# EAGLE design Wallboxsteuerung22042021 (EAGLE 7.5.0)
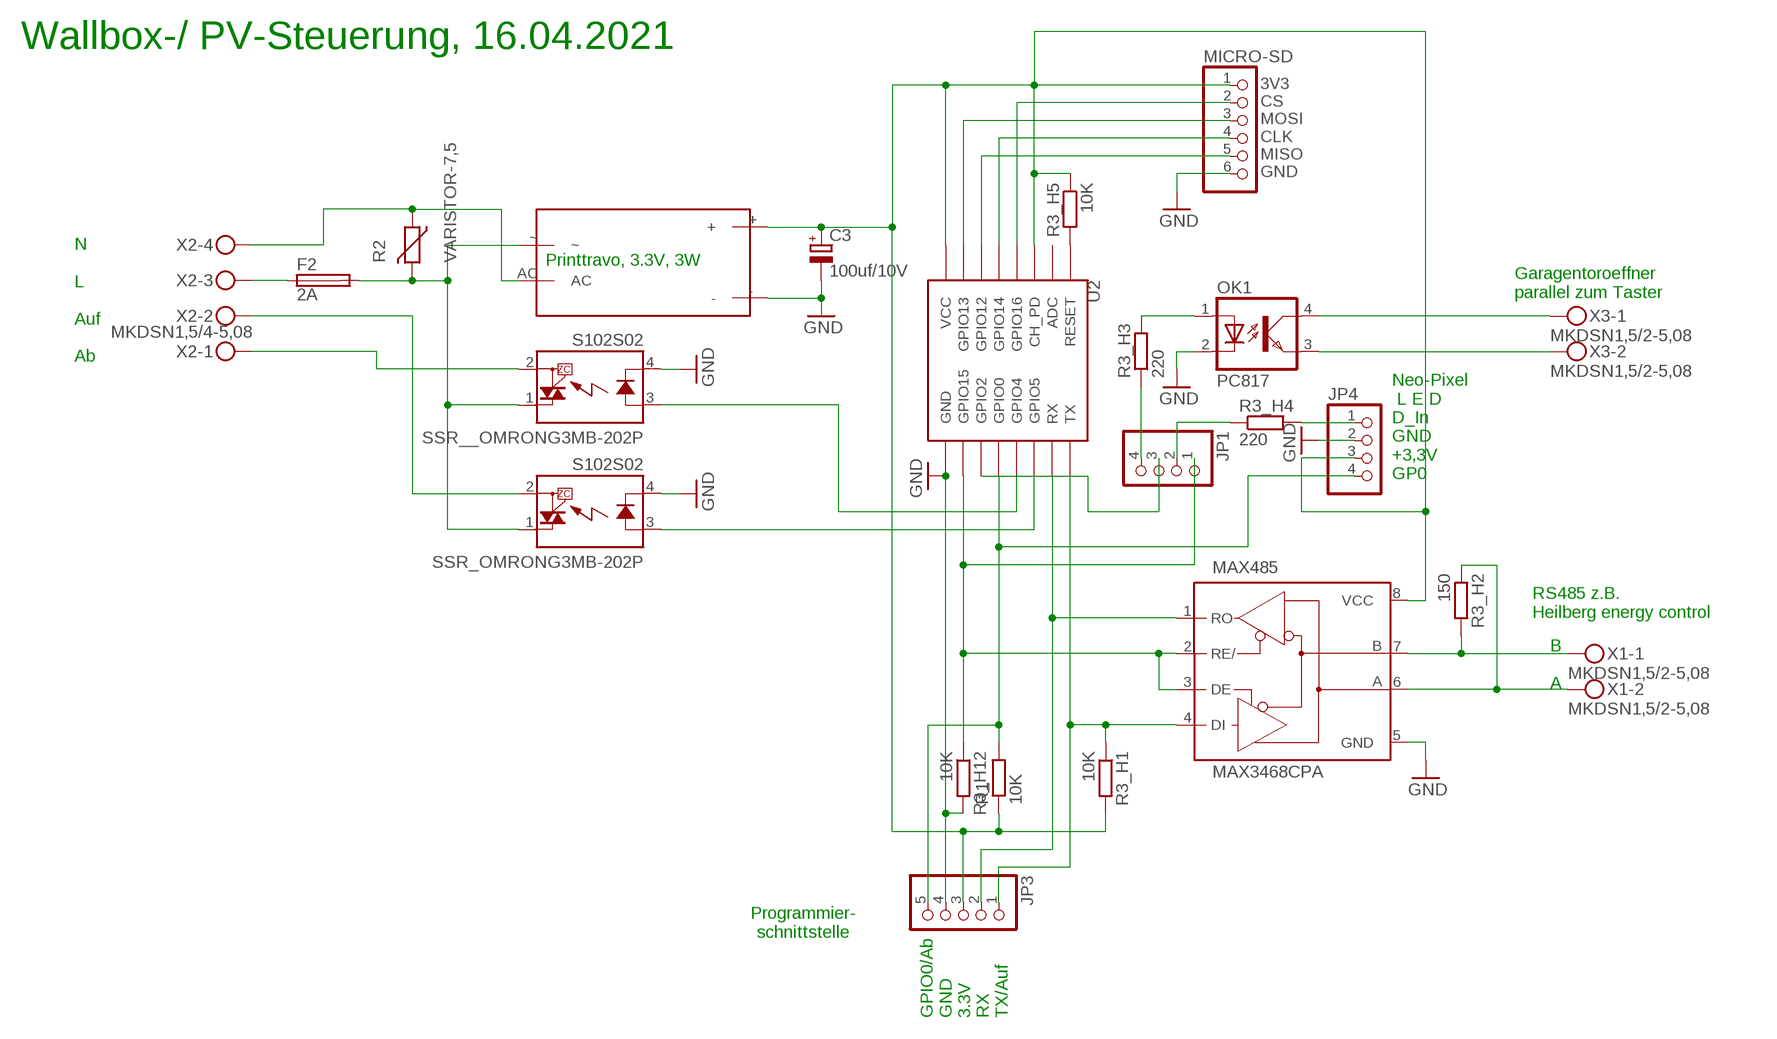
[diagram p0: schematic, sheet 1]

## Parts
C3  100uf/10V  CPOL-EUE2.5-7  [E2,5-7]
F2  2A  LITTLEFUSE  [LITTLEFUSE]
JP1  PINHD-1X4  [1X04]
JP3  PINHD-1X5  [1X05]
JP4  PINHD-1X4  [1X04]
MAX485  MAX3468CPA  [DIL08]
MICRO-SD  PINHD-1X6  [1X06]
OK1  PC817  [DIL04]
PRINTTRAFO3.3V,_3W  PRINTTRAFO  [PRINTTRAFO]
R1  10K  R-EU_0207/7  [0207/7]
R2  VARISTOR-7,5  [R-7,5]
R3_H1  10K  R-EU_0309/V  [0309V]
R3_H2  150  R-EU_0309/V  [0309V]
R3_H3  220  R-EU_0309/V  [0309V]
R3_H4  220  R-EU_0309/V  [0309V]
R3_H5  10K  R-EU_0309/V  [0309V]
R3_H12  10K  R-EU_0207/2V  [0207/2V]
SSR__OMRONG3MB-202P  S102S02  [S202S02]
SSR_OMRONG3MB-202P  S102S02  [S202S02]
U2  ESP12SMD  [ESP12-SMD]
X1  MKDSN1,5/2-5,08  [MKDSN1,5/2-5,08]
X2  MKDSN1,5/4-5,08  [MKDSN1,5/4-5,08]
X3  MKDSN1,5/2-5,08  [MKDSN1,5/2-5,08]

## Nets
GND: C3.- JP3.4 JP4.2 MAX485.5(GND) MICRO-SD.6 OK1.2(C) PRINTTRAFO3.3V,_3W.- R3_H12.2 SSR__OMRONG3MB-202P.4(K) SSR_OMRONG3MB-202P.4(K) U2.GND
N$1: SSR_OMRONG3MB-202P.3(A) U2.GPIO4(GPIO5)
N$2: F2.1 X2.3
N$3: SSR__OMRONG3MB-202P.3(A) U2.GPIO5(GPIO4)
N$4: SSR_OMRONG3MB-202P.2(DS2) X2.2
N$5: R3_H5.2 U2.RESET
N$6: JP3.2 MAX485.1(RO) U2.RXD0(RX)
N$7: PRINTTRAFO3.3V,_3W.AC R2.1 X2.4
N$8: JP4.1 R3_H4.2
N$9: JP1.3 U2.GPIO2
N$10: MICRO-SD.4 U2.GPIO14
N$11: JP3.5 JP4.4 R1.2 U2.GPIO0
N$12: F2.2 PRINTTRAFO3.3V,_3W.~ R2.2 SSR__OMRONG3MB-202P.1(DS1) SSR_OMRONG3MB-202P.1(DS1)
N$13: SSR__OMRONG3MB-202P.2(DS2) X2.1
N$14: MICRO-SD.5 U2.GPIO12
N$15: MICRO-SD.3 U2.GPIO13
N$16: JP1.4 R3_H3.1
N$17: MICRO-SD.2 U2.GPIO16
N$19: JP3.1 MAX485.4(DI) R3_H1.1 U2.TXD0(TX)
N$20: OK1.1(A) R3_H3.2
N$21: MAX485.7(B) R3_H2.2 X1.1
N$22: MAX485.6(A) R3_H2.1 X1.2
N$23: OK1.3(EMIT) X3.2
N$24: OK1.4(COL) X3.1
N$25: JP1.2 R3_H4.1
N$26: JP1.1 MAX485.2(RE/) MAX485.3(DE) R3_H12.1 U2.GPIO15
N$27: C3.+ JP3.3 JP4.3 MAX485.8(VCC) MICRO-SD.1 PRINTTRAFO3.3V,_3W.+ R1.1 R3_H1.2 R3_H5.1 U2.CH_PD U2.VCC
Unconnected: U2.ADC

## Notes on the sheet
- Wallbox-/ PV-Steuerung, 16.04.2021
- 3V3
  CS
  MOSI
  CLK
  MISO
  GND
- N
  
  L
  
  Auf
  
  Ab
- Printtravo, 3.3V, 3W
- Garagentoroeffner
  parallel zum Taster
- Neo-Pixel
   L E D
  D_In
  GND
  +3,3V
  GP0
- RS485 z.B. 
  Heilberg energy control
- B
  
  A
- Programmier-
  schnittstelle
- GPIO0/Ab
  GND
  3.3V
  RX
  TX/Auf

## Library data of the parts
C3 = rcl:CPOL-EU: POLARIZED CAPACITOR, European symbol
F2 = fuse:LITTLEFUSE: LITTLEFUSE Picofuse/slow Littlefuse; OC_FARNELL: unknown; OC_NEWARK: unknown
JP1 JP4 = pinhead:PINHD-1X4: PIN HEADER
JP3 = pinhead:PINHD-1X5: PIN HEADER
MAX485 = maxim:MAX34*: +5V, Fail-Safe, 40Mbps, Profibus RS-485/RS-422 Transceivers Source: MAX3465-MAX3469.pdf; OC_FARNELL: unknown; OC_NEWARK: unknown
MICRO-SD = pinhead:PINHD-1X6: PIN HEADER
OK1 = optocoupler:PC817: SHARP OPTO COUPLER; MPN: PC817X4J000F; OC_FARNELL: 9707727; OC_NEWARK: 97K7059
PRINTTRAFO3.3V,_3W = Uwes_lib:PRINTTRAFO
R1 R3_H1-R3_H5 R3_H12 = rcl:R-EU_: RESISTOR, European symbol
R2 = varistor:VARISTOR: VARISTOR
SSR__OMRONG3MB-202P SSR_OMRONG3MB-202P = relay:S*02S02: IT(rms) 8A, Zero Cross type SIP 4pin Triac output SSR Source: http://sharp-world.com/products/device/lineup/data/pdf/datasheet/s102s02_e.pdf; OC_FARNELL: unknown; OC_NEWARK: unknown
U2 = uwe_esp8266modules:ESP12: ESP8266 Wifi module 12
X1 X3 = con-phoenix-508:MKDSN1,5/2-5,08: MKDSN 1,5/ 2-5,08 Printklemme Nennstrom: 13,5 A Nennspannung: 250 V Rastermaß: 5,08 mm Polzahl: 2 Anschlussart: Schraubanschluss Montage: Löten Anschlussrichtung Leiter/Platine: 0 ° Artikelnummer: 1729128 Source: http://eshop.phoenixcontact.com .. 1729128.pdf
X2 = con-phoenix-508:MKDSN1,5/4-5,08: MKDSN 1,5/ 4-5,08 Printklemme Nennstrom: 13,5 A Nennspannung: 250 V Rastermaß: 5,08 mm Polzahl: 4 Anschlussart: Schraubanschluss Montage: Löten Anschlussrichtung Leiter/Platine: 0 ° Artikelnummer: 1729144 Source: http://eshop.phoenixcontact.com .. 1729144.pdf

## Board
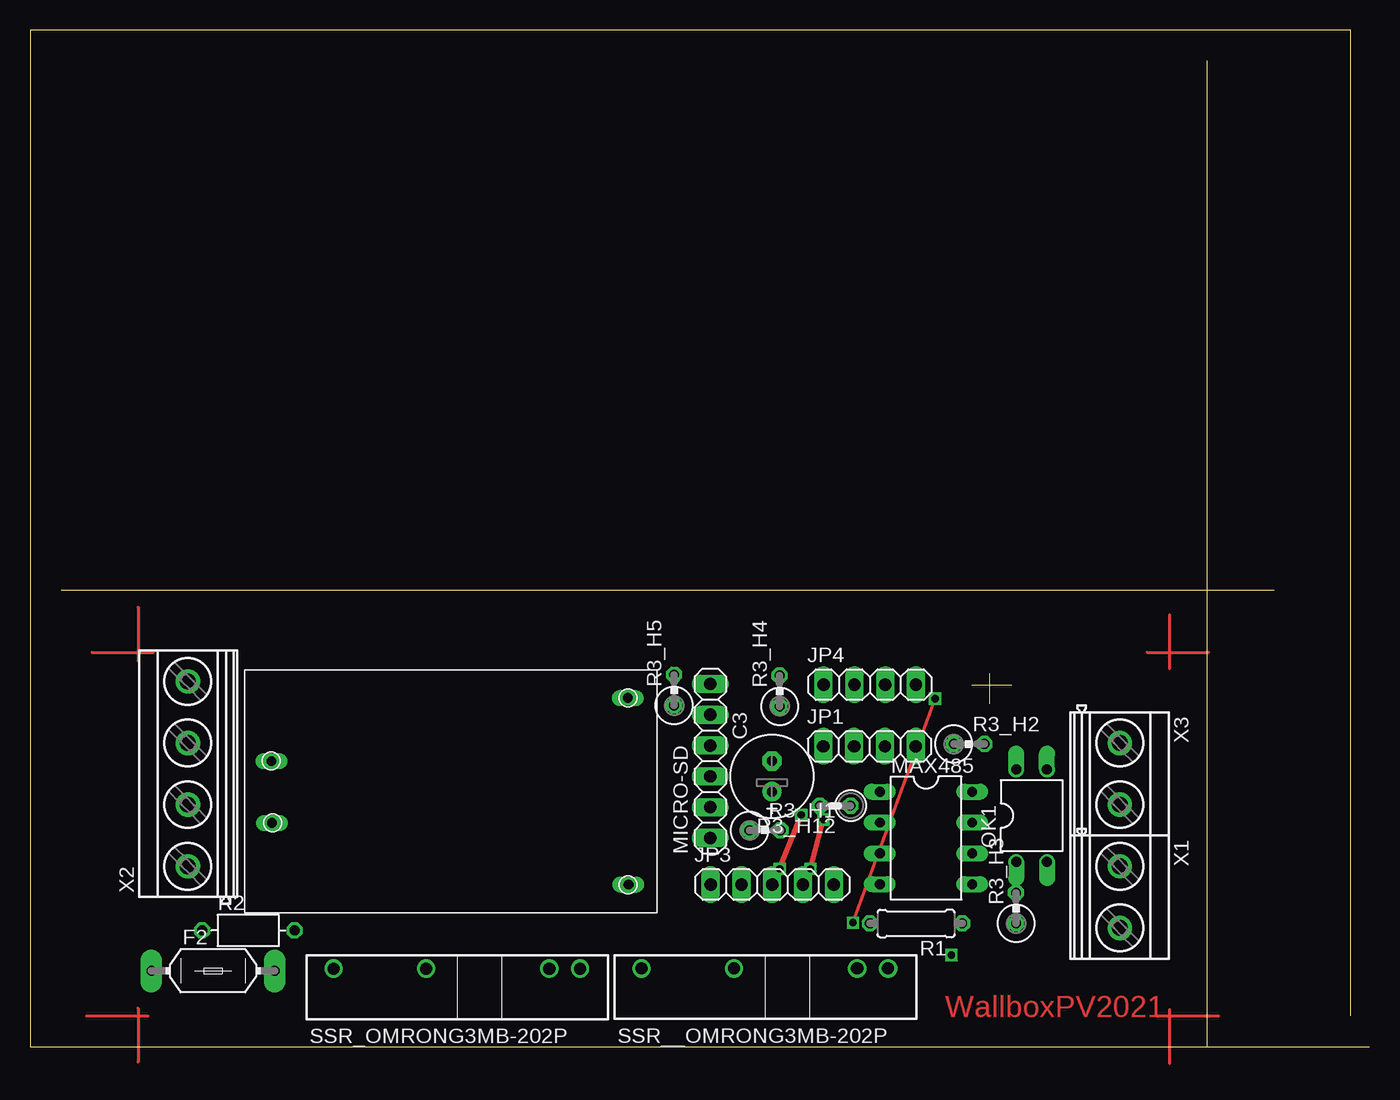
[diagram p1: board, top side]
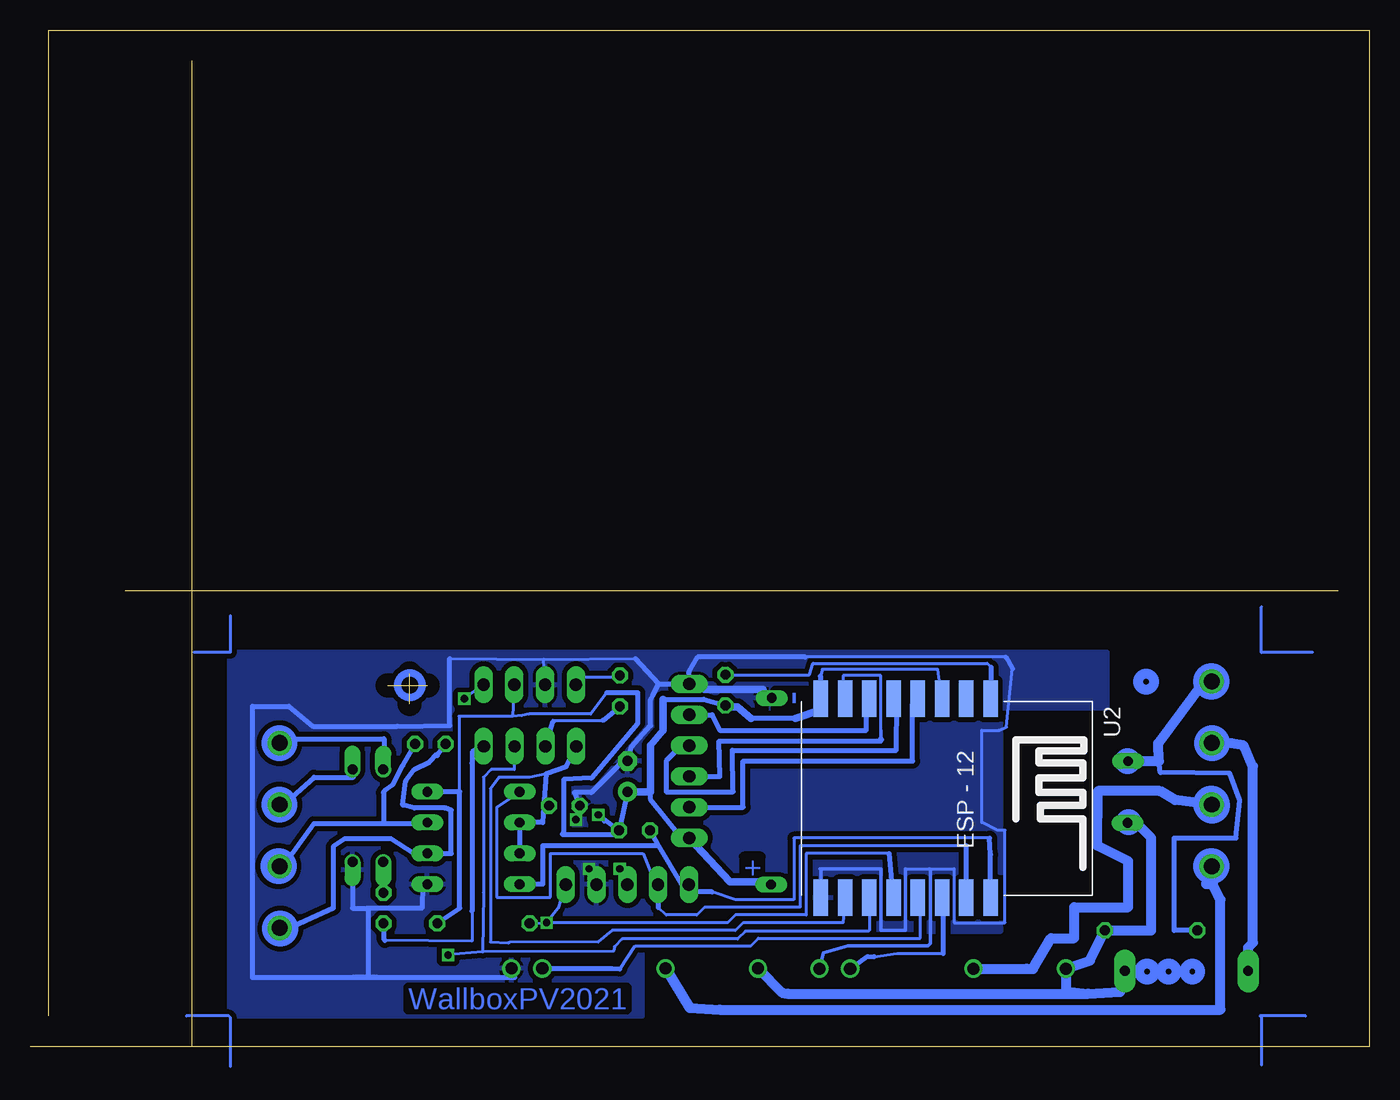
[diagram p2: board, bottom side, seen from below]

Size 110.39 x 83.81 mm. Coordinates in mm from the lower left corner, seen from the top.
Outline: 108.89,2.54 108.89,83.81 0,83.81 0,0 110.39,0
Outline: 97.06,0.04 97.06,81.31
Outline: 102.56,37.61 2.56,37.61
Outline: 79.1,28.26 79.1,30.79
Outline: 80.94,29.78 77.64,29.77
Copper layers (1*16): Top 0.035mm / dielectric 1.5mm / Bottom 0.035mm
Design rules "default": minimum track width 10mil, minimum drill 24mil, track to track 8mil, track to pad 8mil, pad to pad 8mil, via to via 8mil, smd to smd 8mil, copper to edge 40mil, drill to drill 8mil, minimum pad ring 10mil, minimum via ring 8mil, stop-mask expansion 4mil, vias tented up to drill 0mil, thermal gap 10mil

### Footprints (pad centres in the part's own frame; a part is rotated, then mirrored left to right if it is on the bottom)
E2,5-7 = drill 0.813 pad 1.6: + -1.27,0 | drill 0.813 pad 1.6 octagon: - 1.27,0
LITTLEFUSE = drill 0.813 pad 1.778 long: 1 -5.08,0; 2 5.08,0
1X04 = drill 1.016 long: 1 -3.81,0; 2 -1.27,0; 3 1.27,0; 4 3.81,0
1X05 = drill 1.016 long: 1 -5.08,0; 2 -2.54,0; 3 0,0; 4 2.54,0; 5 5.08,0
DIL08 = drill 0.813 long: 1 -3.81,-3.81; 2 -1.27,-3.81; 3 1.27,-3.81; 4 3.81,-3.81; 5 3.81,3.81; 6 1.27,3.81; 7 -1.27,3.81; 8 -3.81,3.81
1X06 = drill 1.016 long: 1 -6.35,0; 2 -3.81,0; 3 -1.27,0; 4 1.27,0; 5 3.81,0; 6 6.35,0
DIL04 = drill 0.813 offset: 1 -1.27,-3.81; 2 1.27,-3.81; 3 1.27,3.81; 4 -1.27,3.81
PRINTTRAFO = drill 0.8 long: + -15.383,7.646; - -15.333,-7.753; AC 14.067,-2.554; ~ 14.017,2.546
0207/7 = drill 0.813 octagon: 1 -3.81,0; 2 3.81,0
R-7,5 = drill 0.813 octagon: 1 -3.81,0; 2 3.81,0
0309V = drill 0.813 octagon: 1 -1.27,0; 2 1.27,0
0207/2V = drill 0.813 octagon: 1 -1.27,0; 2 1.27,0
S202S02 = drill 1: 1 -7.62,1.524; 2 0,1.524; 3 10.16,1.524; 4 12.7,1.524
ESP12-SMD = smd 3 x 1.2: ADC -8.3,3.8; CH_PD -8.3,1.8; GND 8.1,-8.2; GPIO0 8.1,-2.2; GPIO2 8.1,-4.2; GPIO4 8.1,1.8; GPIO5 8.1,-0.2; GPIO12 -8.3,-4.2; GPIO13 -8.3,-6.2; GPIO14 -8.3,-2.2; GPIO15 8.1,-6.2; GPIO16 -8.3,-0.2; RESET -8.3,5.8; RXD0 8.1,3.8; TXD0 8.1,5.8; VCC -8.3,-8.2
MKDSN1,5/2-5,08 = drill 1.3 pad 2: 1 -2.561,0.025; 2 2.519,0.025
MKDSN1,5/4-5,08 = drill 1.3 pad 2: 1 -7.641,0.025; 2 -2.561,0.025; 3 2.519,0.025; 4 7.599,0.025

### Placement (x,y rotation side)
C3  61.15,22.29 90 top
F2  15.06,6.25 0 top
JP1  69.19,24.77 0 top
JP3  61.17,13.38 0 top
JP4  69.22,29.84 0 top
MAX485  73.85,17.21 270 top
MICRO-SD  56.07,23.56 90 top
OK1  82.56,19.05 0 top
PRINTTRAFO3.3V,_3W  33.93,21 180 top
R1  73.03,10.16 180 top
R2  17.97,9.59 0 top
R3_H1  60.58,17.84 0 top
R3_H2  77.41,24.96 0 top
R3_H3  81.28,11.43 90 top
R3_H4  61.79,29.34 90 top
R3_H5  53.09,29.4 90 top
R3_H12  66.36,19.88 180 top
SSR__OMRONG3MB-202P  58.02,4.93 0 top
SSR_OMRONG3MB-202P  32.63,4.91 0 top
U2  37.02,20.38 270 bottom
X1  89.81,12.31 270 top
X2  13.01,22.52 90 top
X3  89.81,22.48 270 top

### Tracks (layer width: path | path; a pad name or v marks a point on that pad's centre or on a via)
GND  (via drill 0.6)
  Top 0.406: v64.33,14.67 v65.41,18.73
  Bottom 0.254: 38.23,14.67 36.26,14.67 34.23,14.67 34.23,10.22 30.04,10.22 30.04,17.84 30.67,17.84 31.94,18.48 31.94,26.1 30.54,26.1 29.9,26.37 29.4,31.18 | 29.97,32.13 46.48,32.13 | 75.82,32 68.07,31.94 | 68.07,31.94 60.52,32 | JP4.2 68.07,31.94
  Bottom 0.305: U2.GND 45.22,14.61 45.28,14.67 40.26,14.67 40.26,9.59 38.23,9.59 38.23,14.67 | 36.26,14.67 36.2,14.61 36.2,8.51 36.39,8.32 42.97,8.32 45.01,7.74 SSR_OMRONG3MB-202P.4
  Bottom 0.406: 58.61,29.91 59.05,28.96 59.24,28.64 59.24,26.48 60.83,24.7 C3.- 61.53,23.56 64.13,20.95 65.53,20.95 R3_H12.2 v65.41,18.73 | 58.61,29.91 MICRO-SD.6 | 49.97,29.46 PRINTTRAFO3.3V,_3W.- | JP3.4 64.34,14.65 v64.33,14.67 | MICRO-SD.6 56.07,30.92 55.37,32.13 46.48,32.13 | 29.97,32.13 29.4,31.18 | 54.8,29.46 55.44,29.46 MICRO-SD.6 | 60.52,32 58.61,29.91 | OK1.2 83.83,11.43 82.61,11.43 | 83.82,5.71 92.08,5.71 92.08,28.07 89.05,28.07 87.08,26.42 80.14,26.42 75.82,26.48 75.82,32 | 83.82,5.71 82.49,5.71 | 82.49,5.71 70.46,5.71 SSR__OMRONG3MB-202P.4 | MAX485.5 78.04,13.4 78.11,11.43 82.61,11.43 | 81.83,5.72 83.82,5.71 | 82.61,11.43 82.55,11.37 82.55,5.78 82.49,5.71
  Bottom 0.61: 54.8,29.46 49.97,29.46
  pour Bottom (isolate 0.406): 21.59,32.52 93.98,32.52 93.98,2.54 59.92,2.54 59.92,9.53 30.34,9.53 30.34,27.94 21.59,27.94
N$1
  Bottom 0.254: 40.83,7.41 38.92,7.68 35.12,7.68
  Bottom 0.406: SSR_OMRONG3MB-202P.3 41.35,7.43 40.83,7.41 | 35.12,7.68 35.12,12.18 U2.GPIO4
N$2
  Bottom 0.813: X2.3 11.36,25.02 10.35,24.83 9.62,23.14 9.59,23.11 9.59,8.57 9.98,8.18 F2.1
N$3
  Bottom 0.254: 61.79,6.41 60.52,8.32 50.99,8.32 50.36,8.95 37.02,8.95 37.02,12.08
  Bottom 0.406: SSR__OMRONG3MB-202P.3 62.46,6.45 61.79,6.41 | 37.02,12.08 U2.GPIO5
N$4
  Bottom 0.813: SSR_OMRONG3MB-202P.2 28.25,6.43 27.73,6.41 26.23,8.95 24.32,8.95 24.32,11.49 19.88,11.49 19.88,15.3 22.41,16.57 22.35,21.08 17.27,21.08 16.02,20.34 X2.2
N$5
  Bottom 0.254: R3_H5.2 46.16,30.67 45.85,31.62 31.5,31.62 31.18,31.3
  Bottom 0.406: 31.18,31.3 U2.RESET
N$6
  Bottom 0.254: MAX485.1 71.95,19.75 71.95,12.32 67.5,12.32 67.5,15.94 59.88,15.94 58.61,12.76 | 33.21,16.57 46.93,16.57 46.93,11.49 54.8,11.49 55.44,10.86 57.98,10.86 58.61,11.45
  Bottom 0.406: 58.61,12.76 JP3.2 58.61,11.45 | U2.RXD0 33.22,14.66 33.21,16.57
N$7
  Bottom 0.406: R2.1 16.07,9.59 16.07,17.21 10.99,17.21 10.67,20.32 11.49,22.54 17.21,22.61 17.34,23.56
  Bottom 0.813: PRINTTRAFO3.3V,_3W.AC 17.34,23.56 17.4,25.02 13.6,30.1 X2.4
N$8
  Bottom 0.254: JP4.1 65.41,30.48 61.91,30.48 R3_H4.2
N$9  (via drill 0.6)
  Bottom 0.254: U2.GPIO2 41.22,9.58 41.27,9.53 51.44,9.53 52.07,8.89 61.59,8.89 62.23,8.25 62.29,7.87 73.08,7.82 | 73.08,7.82 v75.95,7.56 | 73.08,7.82 73.03,12.7 73.03,22.22 72.39,22.86 70.48,22.86 JP1.3 70.4,24.62
  Bottom 0.406: 70.4,24.62 70.41,24.88
N$10
  Bottom 0.406: MICRO-SD.4 56.71,24.83 57.98,23.56 57.98,21.02 52.45,21.02 52.51,24.45 38.99,24.45 38.92,28.39 U2.GPIO14
N$11  (via drill 0.6)
  Top 0.254: v67.82,10.22 v74.61,28.7
  Bottom 0.254: 39.56,15.94 46.42,15.94 46.42,10.86 52.26,10.86 52.9,10.22 v67.82,10.22 | JP3.5 66.87,11.43 v67.82,10.22 | v74.61,28.7 JP4.4 | R1.2 v67.82,10.22
  Bottom 0.406: U2.GPIO0 39.56,15.94
N$12
  Bottom 0.813: SSR__OMRONG3MB-202P.1 48.4,4.46 47.94,4.38 23.18,4.38 | 23.18,4.38 20.56,4.51 F2.2 | 23.18,4.38 25.01,4.55 SSR_OMRONG3MB-202P.1 23.01,7.09 R2.2 17.97,9.59 17.97,17.21 19.24,18.48 19.89,18.48 PRINTTRAFO3.3V,_3W.~
N$13
  Bottom 0.813: SSR__OMRONG3MB-202P.2 56.02,3.19 53.53,3.05 12.26,3.05 12.26,12.13 12.89,13.4 13.45,13.4 X2.1
N$14
  Bottom 0.406: MICRO-SD.5 54.17,27.37 53.53,26.1 41.47,26.1 41.47,28.44 U2.GPIO12
N$15
  Bottom 0.254: 40.26,26.1 40.26,30.61 43.37,30.61 43.37,28.83 U2.GPIO13
  Bottom 0.305: 40.26,25.4 40.26,26.1
  Bottom 0.406: 43.37,28.53 U2.GPIO13 | MICRO-SD.3 53.53,22.29 53.59,25.21 40.26,25.21 40.2,25.34 40.26,25.4
N$16
  Bottom 0.254: 73.98,11.24 73.98,11.18 73.98,8.7 81.15,8.76
  Bottom 0.406: JP1.4 73.95,24.3 73.98,23.37 73.98,11.18 | 81.15,8.76 81.22,8.83 R3_H3.1
N$17
  Bottom 0.406: MICRO-SD.2 51.63,19.75 51.63,23.56 37.66,23.56 37.66,28.25 U2.GPIO16
N$18
  Top 0.254: 8.89,36.26 8.89,31.81 | 8.89,3.17 8.89,-1.27 | 93.92,35.62 93.92,31.18 | 93.92,3.05 93.92,-1.4
N$19
  Bottom 0.254: 31.31,17.21 47.43,17.21 47.43,12.13 52.26,12.13 54.17,12.76
  Bottom 0.406: 58.61,16.57 56.71,13.4 56.07,13.36 JP3.1 55.43,12.76 54.17,12.76 | 58.61,16.57 68.13,16.57 68.13,13.4 MAX485.4 | U2.TXD0 31.22,15.85 31.31,17.21 | R3_H1.1 58.61,16.57
N$20
  Bottom 0.406: R3_H3.2 81.28,13.96 OK1.1
N$21
  Bottom 0.406: X1.1 89.53,14.87 87,18.41 81.28,18.41 | 81.28,18.41 77.72,18.41 MAX485.7 | R3_H2.2 79.69,23.18 80.52,21.59 81.22,21.08 81.28,20.95 81.28,18.41
N$22
  Bottom 0.406: X1.2 89.57,9.53 85.41,11.43 85.41,16.51 84.45,17.14 80.64,17.14 78.8,15.94 MAX485.6 76.26,15.94 75.69,15.94 75.69,19.49 76.2,19.68 78.74,19.68 79.69,19.94 79.44,21.91 78.74,22.86 77.47,23.49 76.83,24.13 76.83,24 R3_H2.1
N$23
  Bottom 0.406: X3.2 89.53,19.96 87,22.22 83.76,22.22 OK1.3
N$24
  Bottom 0.406: X3.1 89.53,25.04 89.53,25.4 81.22,25.4 OK1.4
N$25
  Bottom 0.254: 67.28,26.82 67.31,26.92 63.18,26.92
  Bottom 0.406: JP1.2 67.28,26.82 | 63.18,26.92 R3_H4.1
N$26
  Bottom 0.254: U2.GPIO15 43.37,10.22 51.63,10.22 52.26,9.59 62.42,9.59 63.56,8.64 70.86,8.61 70.99,8.57 72.45,8.64 72.45,21.27 71.75,22.22 69.22,22.22 67.88,22.48 | R3_H12.1 68.06,19.73
  Bottom 0.406: MAX485.3 MAX485.2 68.13,18.48 68.06,19.73 67.88,22.48 66.21,23.07 JP1.1
N$27  (via drill 0.6)
  Top 0.406: v61.79,14.67 63.06,17.78 v63.56,19.11
  Bottom 0.254: U2.CH_PD 35.56,31.11 45.09,31.11 45.25,30.55 | 75.06,21.02 75.06,27.24 70.61,27.24 | 62.87,29.21 64.2,27.43 69.28,27.43 69.85,27.3 70.61,27.24 | JP4.3 70.61,27.24
  Bottom 0.406: U2.VCC 45.25,30.55 45.25,27.76 | C3.+ R3_H1.2 | MAX485.8 75.06,21.02 74.99,21.02 74.99,11.43 R1.1 | 49.09,13.59 PRINTTRAFO3.3V,_3W.+ | MICRO-SD.1 56.71,17.21 59.24,20.38 59.24,21.02 | 47.31,27.05 50.99,27.05 | 52.96,28 R3_H5.1 54.86,28.64 58.23,28.64 | JP3.3 61.17,14.01 v61.79,14.67 | R3_H1.2 v63.56,19.11 63.06,18.61 | 62.87,29.21 60.33,29.21 60.33,26.67 64.13,22.16 66.42,22.03 66.42,17.72 66.55,17.53 62.17,17.53 R3_H1.2
  Bottom 0.61: 58.23,28.64 58.23,26.1 59.24,24.83 59.24,21.02 C3.+ | MICRO-SD.1 52.7,13.59 49.09,13.59 | 45.25,27.76 47.31,27.05 | 50.99,27.05 52.07,28 52.96,28
N$29
  Bottom 0.254: 8.93,32.54 4.66,32.54
N$30
  Bottom 0.254: 8.89,32.51 8.89,36.28
N$31
  Bottom 0.254: 8.89,2.4 8.89,-1.5
N$32
  Bottom 0.254: 5.23,2.54 9,2.54
N$33
  Bottom 0.254: 94.03,2.54 97.53,2.54
N$34
  Bottom 0.254: 93.89,-1.63 93.89,2.41
N$35
  Bottom 0.254: 93.89,35.54 93.89,32.54 96.89,32.54
N$36
  Top 0.254: 5.08,32.51 10.16,32.51 | 4.64,2.54 9.72,2.54 | 92.08,32.51 97.16,32.51 | 92.9,2.54 97.98,2.54
(copper drawn outside any net)
  shapes: Bottom circle x16

### Text on the board
Top: WallboxPV2021
Bottom: - | + | WallboxPV2021